# Altium project EGB220 V2.PrjPcb
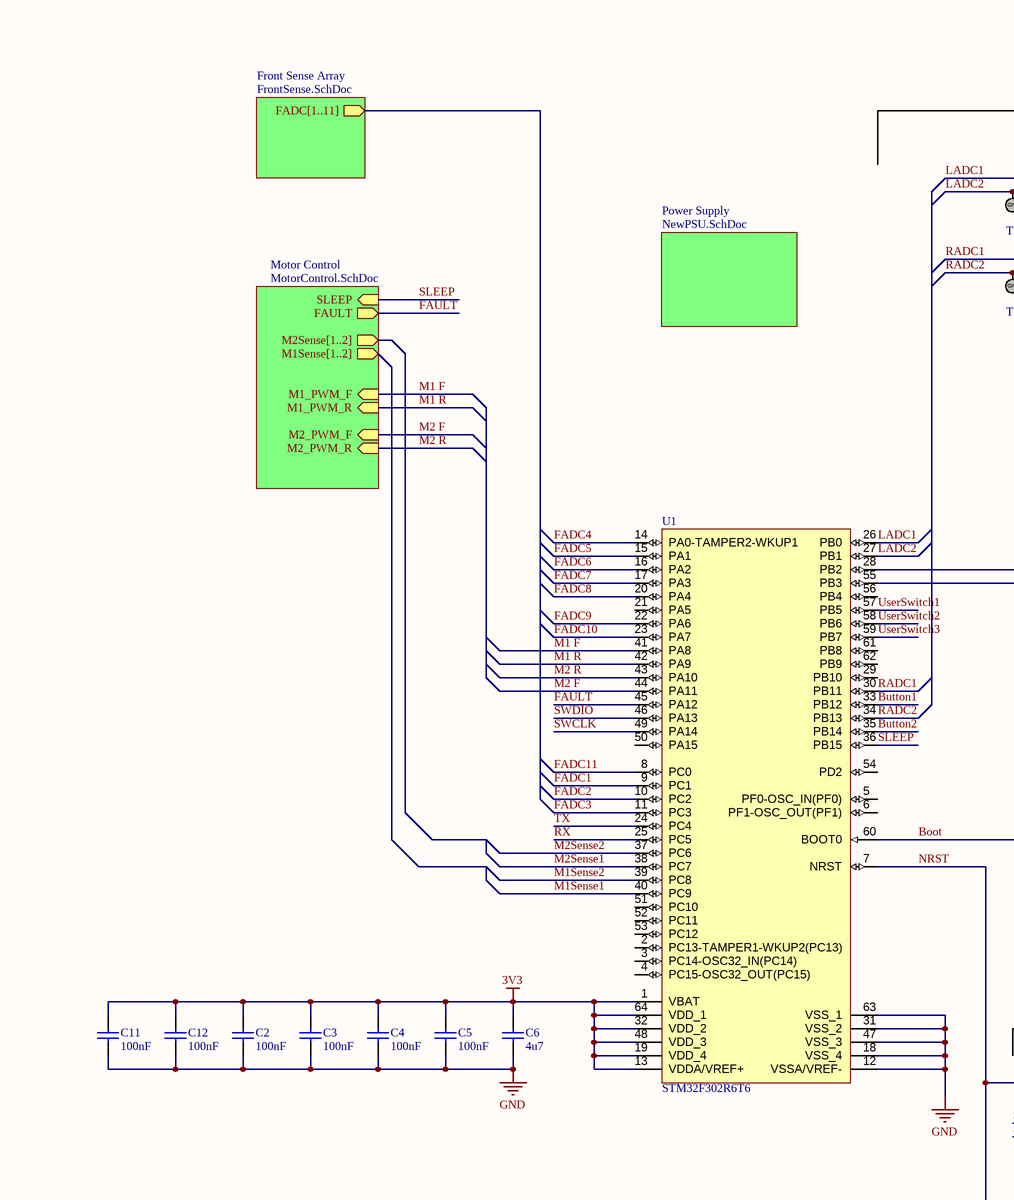
[diagram p0: EGB220.SchDoc, centre column 2 of 4]
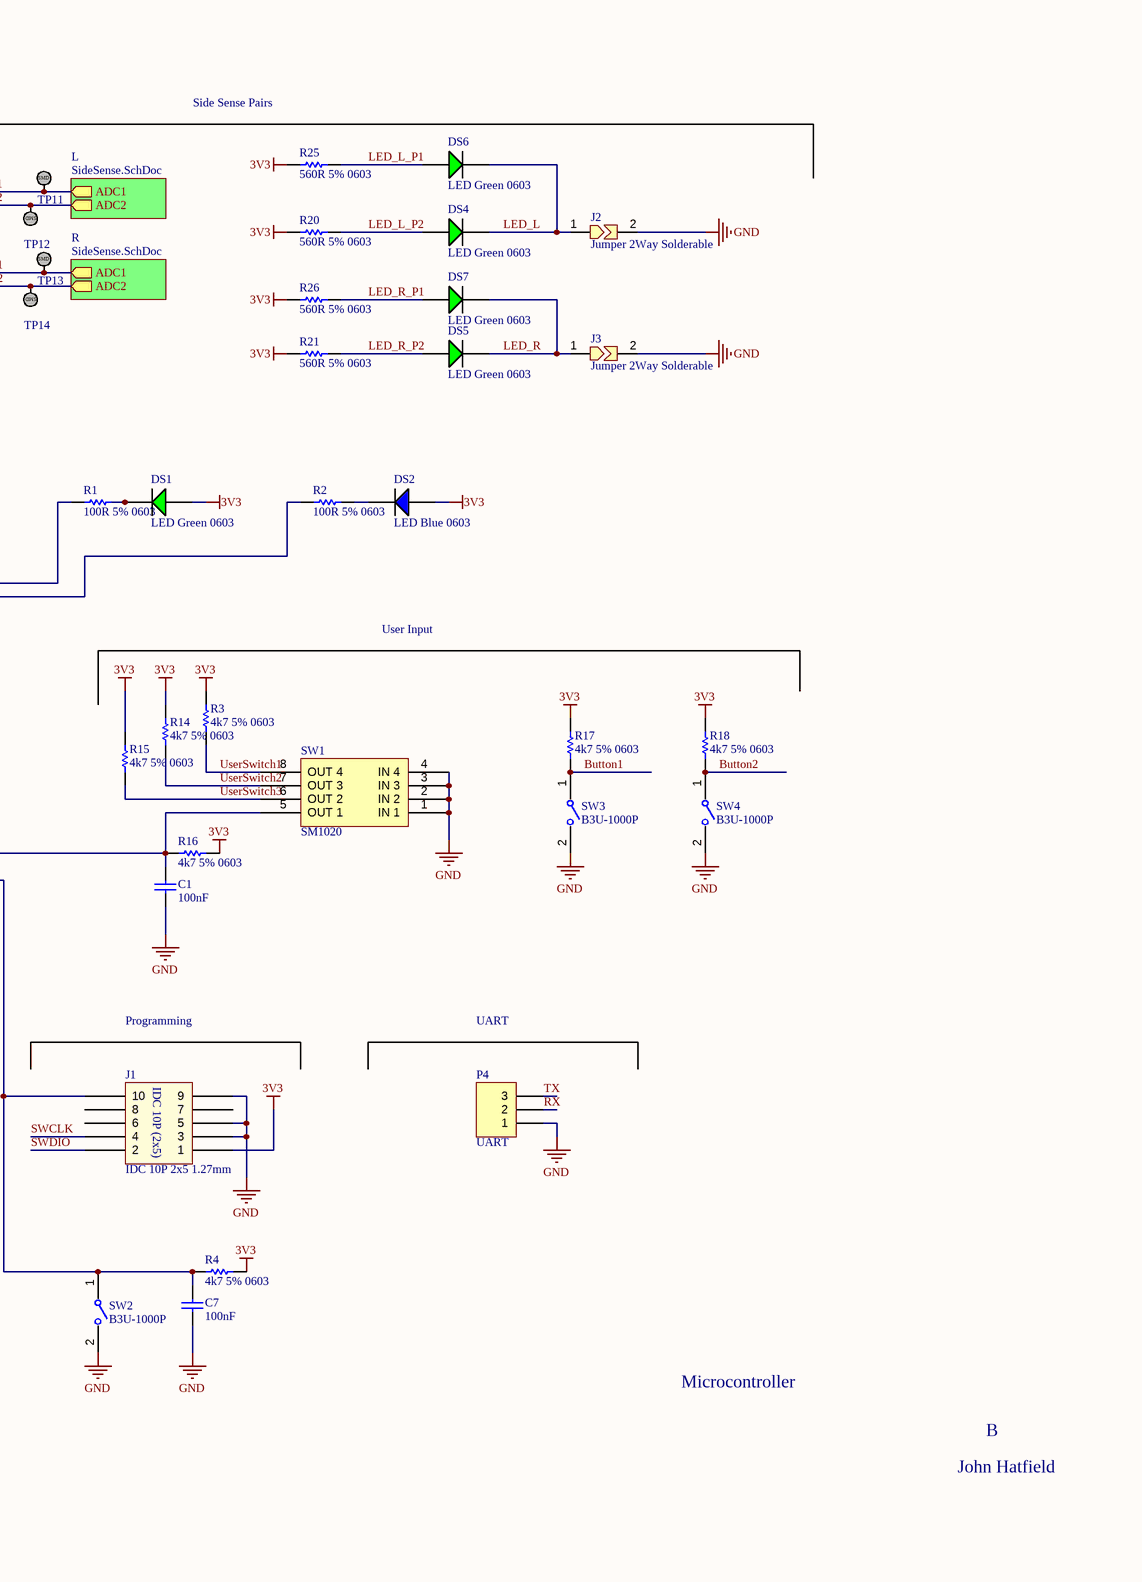
[diagram p1: EGB220.SchDoc, centre column 3 of 4]
6 sheets, 117 parts. Net scope: hierarchical (ports join the sheet entries above them; power ports are global).
Board files: v4.PcbDoc, v3.PcbDoc
Sheets:
  EGB220.SchDoc
    Front Sense Array = FrontSense.SchDoc
      P1 = SensePair.SchDoc
      P2 = SensePair.SchDoc
      P3 = SensePair.SchDoc
      P4 = SensePair.SchDoc
      P5 = SensePair.SchDoc
    Motor Control = MotorControl.SchDoc
    Power Supply = NewPSU.SchDoc
    L = SideSense.SchDoc
    R = SideSense.SchDoc

## Sheet EGB220.SchDoc: Test
size A3; Author: John Hatfield; DrawnBy: John Hatfield; SheetNumber: 1; SheetTotal: 6

### Parts
C1  100nF  [Cap_Ceramic_0603]
C2  100nF  [Cap_Ceramic_0603]
C3  100nF  [Cap_Ceramic_0603]
C4  100nF  [Cap_Ceramic_0603]
C5  100nF  [Cap_Ceramic_0603]
C6  4u7  [Cap_Ceramic_0603]
C7  100nF  [Cap_Ceramic_0603]
C11  100nF  [Cap_Ceramic_0603]
C12  100nF  [Cap_Ceramic_0603]
DS1  LED Green 0603  [LED GREEN 0603]
DS2  LED Blue 0603  [LED BLUE 0603]
DS4  LED Green 0603  [LED GREEN 0603]
DS5  LED Green 0603  [LED GREEN 0603]
DS6  LED Green 0603  [LED GREEN 0603]
DS7  LED Green 0603  [LED GREEN 0603]
J1  IDC 10P 2x5 1.27mm  [IDC 1.27MM 10P]
J2  Jumper 2Way Solderable  [Jumper_2Way_Solderable]
J3  Jumper 2Way Solderable  [Jumper_2Way_Solderable]
P4  UART  [HDR1X3]
R1  100R 5% 0603  [Res_ThinFilm_0603]
R2  100R 5% 0603  [Res_ThinFilm_0603]
R3  4k7 5% 0603  [Res_ThinFilm_0603]
R4  4k7 5% 0603  [Res_ThinFilm_0603]
R14  4k7 5% 0603  [Res_ThinFilm_0603]
R15  4k7 5% 0603  [Res_ThinFilm_0603]
R16  4k7 5% 0603  [Res_ThinFilm_0603]
R17  4k7 5% 0603  [Res_ThinFilm_0603]
R18  4k7 5% 0603  [Res_ThinFilm_0603]
R20  560R 5% 0603  [Res_ThinFilm_0603]
R21  560R 5% 0603  [Res_ThinFilm_0603]
R25  560R 5% 0603  [Res_ThinFilm_0603]
R26  560R 5% 0603  [Res_ThinFilm_0603]
SW1  SM1020  [SM1020]
SW2  B3U-1000P  [FP-B3U-1000P-MFG]
SW3  B3U-1000P  [FP-B3U-1000P-MFG]
SW4  B3U-1000P  [FP-B3U-1000P-MFG]
TP11  TestPoint_SMD  [TestPointSMD]  (value not drawn)
TP12  TestPoint_SMD  [TestPointSMD]  (value not drawn)
TP13  TestPoint_SMD  [TestPointSMD]  (value not drawn)
TP14  TestPoint_SMD  [TestPointSMD]  (value not drawn)
U1  STM32F302R6T6  [STM-LQFP64_L]

### Sub-sheets
Front Sense Array = FrontSense.SchDoc: FADC[1..11] (out)
L = SideSense.SchDoc: ADC1 (out), ADC2 (out)
Motor Control = MotorControl.SchDoc: M2Sense[1..2] (out), M1Sense[1..2] (out), M1_PWM_F (in), M1_PWM_R (in), M2_PWM_F (in), M2_PWM_R (in), FAULT (out), SLEEP (in)
Power Supply = NewPSU.SchDoc: no entries
R = SideSense.SchDoc: ADC1 (out), ADC2 (out)

### Nets
3V3: C2.2 C3.2 C4.2 C5.2 C6.2 C11.2 C12.2 DS1.1(A) DS2.1(A) J1.1 R3.2 R4.1 R14.2 R15.2 R16.1 R17.2 R18.2 R20.2 R21.2 R25.2 R26.2 U1.1(VBAT) U1.13(VDDA/VREF+) U1.19(VDD_4) U1.32(VDD_2) U1.48(VDD_3) U1.64(VDD_1)
GND: C1.1 C2.1 C3.1 C4.1 C5.1 C6.1 C7.1 C11.1 C12.1 J1.3 J1.5 J1.9 J2.2 J3.2 P4.1 SW1.1(IN_1) SW1.2(IN_2) SW1.3(IN_3) SW1.4(IN_4) SW2.2 SW3.2 SW4.2 U1.12(VSSA/VREF-) U1.18(VSS_4) U1.31(VSS_2) U1.47(VSS_3) U1.63(VSS_1)
Boot: C1.2 R16.2 SW1.5(OUT_1) U1.60(BOOT0)
Button1: R17.1 SW3.1 U1.33(PB12)
Button2: R18.1 SW4.1 U1.35(PB14)
FADC1: U1.9(PC1)
FADC2: U1.10(PC2)
FADC3: U1.11(PC3)
FADC4: U1.14(PA0-TAMPER2-WKUP1)
FADC5: U1.15(PA1)
FADC6: U1.16(PA2)
FADC7: U1.17(PA3)
FADC8: U1.20(PA4)
FADC9: U1.22(PA6)
FADC10: U1.23(PA7)
FADC11: U1.8(PC0)
FAULT: U1.45(PA12) ; sheet Motor Control/FAULT
LADC1: TP11.1 U1.26(PB0) ; sheet L/ADC1
LADC2: TP12.1 U1.27(PB1) ; sheet L/ADC2
LED_L: DS4.2(C) DS6.2(C) J2.1
LED_L_P1: DS6.1(A) R25.1
LED_L_P2: DS4.1(A) R20.1
LED_R: DS5.2(C) DS7.2(C) J3.1
LED_R_P1: DS7.1(A) R26.1
LED_R_P2: DS5.1(A) R21.1
M1 F: U1.41(PA8) ; sheet Motor Control/M1_PWM_F
M1 R: U1.42(PA9) ; sheet Motor Control/M1_PWM_R
M1Sense1: U1.40(PC9)
M1Sense2: U1.39(PC8)
M2 F: U1.44(PA11) ; sheet Motor Control/M2_PWM_F
M2 R: U1.43(PA10) ; sheet Motor Control/M2_PWM_R
M2Sense1: U1.38(PC7)
M2Sense2: U1.37(PC6)
NRST: C7.2 J1.10 R4.2 SW2.1 U1.7(NRST)
RADC1: TP13.1 U1.30(PB11) ; sheet R/ADC1
RADC2: TP14.1 U1.34(PB13) ; sheet R/ADC2
RX: P4.2 U1.25(PC5)
SLEEP: U1.36(PB15) ; sheet Motor Control/SLEEP
SWCLK: J1.4 U1.49(PA14)
SWDIO: J1.2 U1.46(PA13)
TX: P4.3 U1.24(PC4)
UserSwitch1: R3.1 SW1.8(OUT_4) U1.57(PB5)
UserSwitch2: R14.1 SW1.7(OUT_3) U1.58(PB6)
UserSwitch3: R15.1 SW1.6(OUT_2) U1.59(PB7)
NetDS1_2: DS1.2(C) R1.2
NetDS2_2: DS2.2(C) R2.2
NetR1_1: R1.1 U1.28(PB2)
NetR2_1: R2.1 U1.55(PB3)

Not connected (* = marked no-connect by the designer): J1 6 7 8; U1 2(PC13-TAMPER1-WKUP2(PC13)) 3(PC14-OSC32_IN(PC14)) 4(PC15-OSC32_OUT(PC15)) 5(PF0-OSC_IN(PF0)) 6(PF1-OSC_OUT(PF1)) 21(PA5) 29(PB10) 50(PA15) 51(PC10) 52(PC11) 53(PC12) 54(PD2) 56(PB4) 61(PB8) 62(PB9)

### Notes on the sheet
- Side Sense Pairs
- User Input
- Programming
- UART
- Microcontroller
- B
- John Hatfield
- (in symbol IDC 10P 2x5 1.27mm) IDC 10P (2x5)
- (in symbol TestPoint_SMD) SMD

### Library data of the parts
C1-C5 C7 C11 C12 = 100nF 50V 5% X7R 0603: Capacitor, Ceramic, SMD, 100nF, 50V, 5%, X7R, 0603
C6 = 4u7 50V 5% X7R 0603: Capacitor, Ceramic, SMD, 4u7, 50V, 5%, X7R, 0603
J2 J3 = Jumper 2Way Vert Solderable
P4 = Header 3: Header, 3-Pin; LatestRevisionDate: 17-Jul-2002; LatestRevisionNote: Re-released for DXP Platform.; Publisher: Altium Limited
R1 R2 = 100R 5%, 0603: Resistor, SMD, 100R, 0.1W, 5%, 0603
R3 R4 R14-R18 = 4k7 5% 0603: Resistor, SMD, 4k7, 0.1W, 5%, 0603
R20 R21 R25 R26 = 560R 5% 0603: Resistor, SMD, 560R, 0.1W, 5%, 0603
SW1 = SM1020: 4 Pin DIL Switch
SW2-SW4 = CMP-2100-03586-2: SWITCH TACTILE SPST-NO 0.05A 12V; Contact Resistance: 100mR; Operating Force: 1.5N; Max Current Rating: 50mA; Switch Travel: 0.15mm; Actuator Type: Standard; Mechanical Life: 200000Cycles; Ratings: Dust Proof; Illumination Type: Non-Illuminated; Throw Configuration: SPST; Actuator Length: 0.4mm; Switch Function: Off-Mom; Height: 1.2mm; Width: 3mm; Weight: 0.000776oz; Contact Material: Silver; Max Voltage Rating (DC): 12V; Insulation Resistance: 100MR; Lead Free: Lead Free; Current Rating: 50mA; Termination: SMD/SMT; Length: 4mm; Voltage Rating (DC): 12V; Contact Current Rating: 50mA; Orientation: Straight; Depth: 2.5mm; Max Operating Temperature: 70°C; Packaging: Tape and Reel; Min Operating Temperature: -25°C; Package Quantity: 1; Mount: Surface Mount; Electrical Life: 200000Cycles
U1 = CMP-0537-00017-1: ARM Cortex-M4 32-bit MCU, 32 KB Flash, 16 KB Internal RAM, 51 I/Os, 64-Pin LQFP, -40 to 85 degC, Tray; Operating Frequency(F) (Processor speed) (MHz): 72; Internal RAM Size (kB): 16; I/Os (High Current): 51; Supply Voltage(Vcc) min (V): 2; FLASH Size (Prog) (kB): 32; D/A Converter: 1; ComponentLink1Description: Manufacturer URL; Core: ARM Cortex-M4; Mounting Technology: Surface Mount; Packing: Tray; Package Description: 64-Pin Low-profile Quad Flat Package, Body 10 x 10 mm, Pitch 0.5 mm; ComponentLink2URL: http://www.st.com/st-web-ui/static/active/en/resource/technical/document/datasheet/DM00093333.pdf; Package Reference: LQFP64; ComponentLink1URL: http://www.st.com/; ComponentLink2Description: Datasheet; DatasheetVersion: Rev. 5

## Sheet FrontSense.SchDoc
size A4; SheetNumber: 2; SheetTotal: 6
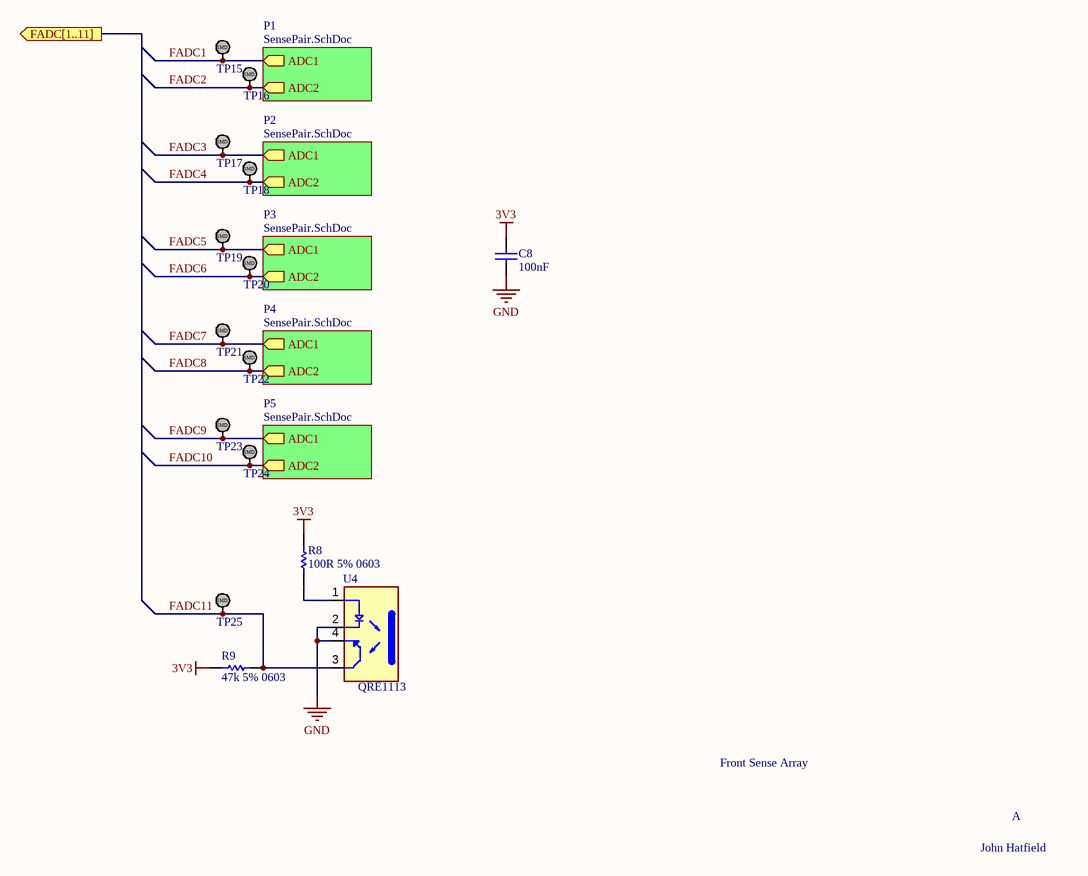
[diagram p2: FrontSense.SchDoc]

### Parts
C8  100nF  [Cap_Ceramic_0603]
R8  100R 5% 0603  [Res_ThinFilm_0603]
R9  47k 5% 0603  [Res_ThinFilm_0603]
TP15  TestPoint_SMD  [TestPointSMD]  (value not drawn)
TP16  TestPoint_SMD  [TestPointSMD]  (value not drawn)
TP17  TestPoint_SMD  [TestPointSMD]  (value not drawn)
TP18  TestPoint_SMD  [TestPointSMD]  (value not drawn)
TP19  TestPoint_SMD  [TestPointSMD]  (value not drawn)
TP20  TestPoint_SMD  [TestPointSMD]  (value not drawn)
TP21  TestPoint_SMD  [TestPointSMD]  (value not drawn)
TP22  TestPoint_SMD  [TestPointSMD]  (value not drawn)
TP23  TestPoint_SMD  [TestPointSMD]  (value not drawn)
TP24  TestPoint_SMD  [TestPointSMD]  (value not drawn)
TP25  TestPoint_SMD  [TestPointSMD]  (value not drawn)
U4  QRE1113  [DIP400W50P180L360H200Q4]

### Sub-sheets
P1 = SensePair.SchDoc: ADC1 (out), ADC2 (out)
P2 = SensePair.SchDoc: ADC1 (out), ADC2 (out)
P3 = SensePair.SchDoc: ADC1 (out), ADC2 (out)
P4 = SensePair.SchDoc: ADC1 (out), ADC2 (out)
P5 = SensePair.SchDoc: ADC1 (out), ADC2 (out)

### Ports
FADC[1..11] (out)

### Nets
3V3: C8.2 R8.2 R9.1
GND: C8.1 U4.2(C) U4.4(ET)
FADC1: TP15.1 ; sheet P1/ADC1
FADC2: TP16.1 ; sheet P1/ADC2
FADC3: TP17.1 ; sheet P2/ADC1
FADC4: TP18.1 ; sheet P2/ADC2
FADC5: TP19.1 ; sheet P3/ADC1
FADC6: TP20.1 ; sheet P3/ADC2
FADC7: TP21.1 ; sheet P4/ADC1
FADC8: TP22.1 ; sheet P4/ADC2
FADC9: TP23.1 ; sheet P5/ADC1
FADC10: TP24.1 ; sheet P5/ADC2
FADC11: R9.2 TP25.1 U4.3(CT)
NetR8_1: R8.1 U4.1(A)

### Notes on the sheet
- Front Sense Array
- A
- John Hatfield
- THIS DOCUMENT AND THE DATA DISCLOSED HEREIN OR
- HEREWITH IS THE PROPERTY OF ALTIUM LIMITED AND MAY
- DWG NO:
- REVISION
- REV:
- DESCRIPTION
- DATE
- APPROVED
- BE FREELY DISTRIBUTED IN WHOLE. NO RIGHTS ARE
- RESERVED OR EXPRESS OR IMPLIED WARANTEE GIVEN.
- ENG:
- APPROVALS
- PROJECT
- DSN:
- CHK:
- REFERENCE DOCUMENTS
- PROJECT REVISION:
- TITLE
- DOCUMENT REVISION:
- DESIGN ITEM:
- BOM:
- FAB DWG:
- PCB DWG:
- ASSY DWG:
- SCALE:
- A3
- SIZE
- CAGE CODE
- FILE NAME
- DWG NO.
- SHEET
- OF
- REV
- (in symbol TestPoint_SMD) SMD

### Library data of the parts
C8 = 100nF 50V 5% X7R 0603: as C1 on sheet EGB220
R8 = 100R 5%, 0603: Resistor, SMD, 100R, 0.1W, 5%, 0603
R9 = 47k 5% 0603: Resistor, SMD, 47k, 0.1W, 5%, 0603
U4 = QRE1113: Reflective Optical Sensor 0.197 _5mm_ 4-DIP _0.157, 4.00mm_; MF: ON Semiconductor; Availability: Unavailable; Package: DIP-4 ON Semiconductor; MP: QRE1113; Value: *; SnapEDA_Link: https://www.snapeda.com/parts/QRE1113/ON%20Semiconductor/view-part/2391104/?ref=snap; Price: None

## Sheet SensePair.SchDoc
size A4; SheetNumber: 3; SheetTotal: 6
Used 5 times, as channels Front Sense Array/P1, Front Sense Array/P2, Front Sense Array/P3, Front Sense Array/P4, Front Sense Array/P5. Parts and nets are listed once, with the designators drawn on the sheet.
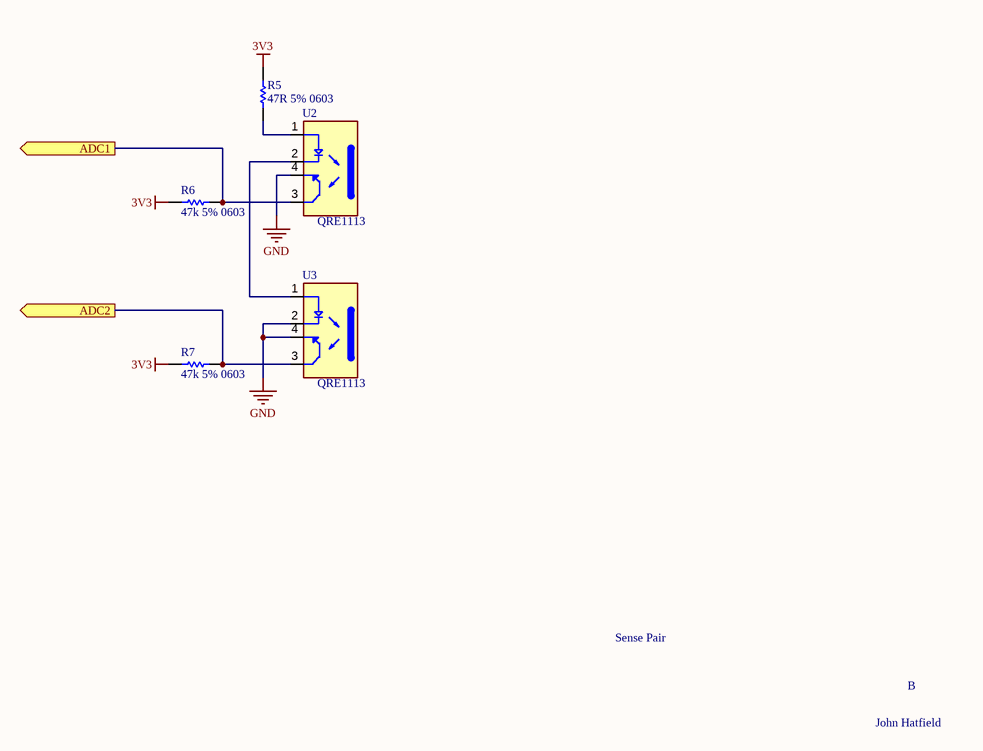
[diagram p3: SensePair.SchDoc]

### Parts
R5  47R 5% 0603  [Res_ThinFilm_0603]
R6  47k 5% 0603  [Res_ThinFilm_0603]
R7  47k 5% 0603  [Res_ThinFilm_0603]
U2  QRE1113  [DIP400W50P180L360H200Q4]
U3  QRE1113  [DIP400W50P180L360H200Q4]

### Ports
ADC1 (out), ADC2 (out)

### Nets
3V3: R5.2 R6.1 R7.1
GND: U2.4(ET) U3.2(C) U3.4(ET)
ADC1: R6.2 U2.3(CT) ; port ADC1
ADC2: R7.2 U3.3(CT) ; port ADC2
NetR5_1: R5.1 U2.1(A)
NetU2_2: U2.2(C) U3.1(A)

### Channels
Front Sense Array/P1: designators R5=P1_R5 R6=P1_R6 R7=P1_R7 U2=P1_U2 U3=P1_U3; ports ADC1=FADC1 ADC2=FADC2
Front Sense Array/P2: designators R5=P2_R5 R6=P2_R6 R7=P2_R7 U2=P2_U2 U3=P2_U3; ports ADC1=FADC3 ADC2=FADC4
Front Sense Array/P3: designators R5=P3_R5 R6=P3_R6 R7=P3_R7 U2=P3_U2 U3=P3_U3; ports ADC1=FADC5 ADC2=FADC6
Front Sense Array/P4: designators R5=P4_R5 R6=P4_R6 R7=P4_R7 U2=P4_U2 U3=P4_U3; ports ADC1=FADC7 ADC2=FADC8
Front Sense Array/P5: designators R5=P5_R5 R6=P5_R6 R7=P5_R7 U2=P5_U2 U3=P5_U3; ports ADC1=FADC9 ADC2=FADC10

### Notes on the sheet
- Sense Pair
- B
- John Hatfield
- THIS DOCUMENT AND THE DATA DISCLOSED HEREIN OR
- HEREWITH IS THE PROPERTY OF ALTIUM LIMITED AND MAY
- DWG NO:
- REVISION
- REV:
- DESCRIPTION
- DATE
- APPROVED
- BE FREELY DISTRIBUTED IN WHOLE. NO RIGHTS ARE
- RESERVED OR EXPRESS OR IMPLIED WARANTEE GIVEN.
- ENG:
- APPROVALS
- PROJECT
- DSN:
- CHK:
- REFERENCE DOCUMENTS
- PROJECT REVISION:
- TITLE
- DOCUMENT REVISION:
- DESIGN ITEM:
- BOM:
- FAB DWG:
- PCB DWG:
- ASSY DWG:
- SCALE:
- A3
- SIZE
- CAGE CODE
- FILE NAME
- DWG NO.
- SHEET
- OF
- REV

### Library data of the parts
R5 = 47R 5% 0603: Resistor, SMD, 47R, 0.1W, 5%, 0603
R6 R7 = 47k 5% 0603: Resistor, SMD, 47k, 0.1W, 5%, 0603
U2 U3 = QRE1113: as U4 on sheet FrontSense; Availability: Unavailable; Package: DIP-4 ON Semiconductor; MP: QRE1113; Value: *; SnapEDA_Link: https://www.snapeda.com/parts/QRE1113/ON%20Semiconductor/view-part/2391104/?ref=snap; Price: None

## Sheet MotorControl.SchDoc
size A3; SheetNumber: 4; SheetTotal: 6
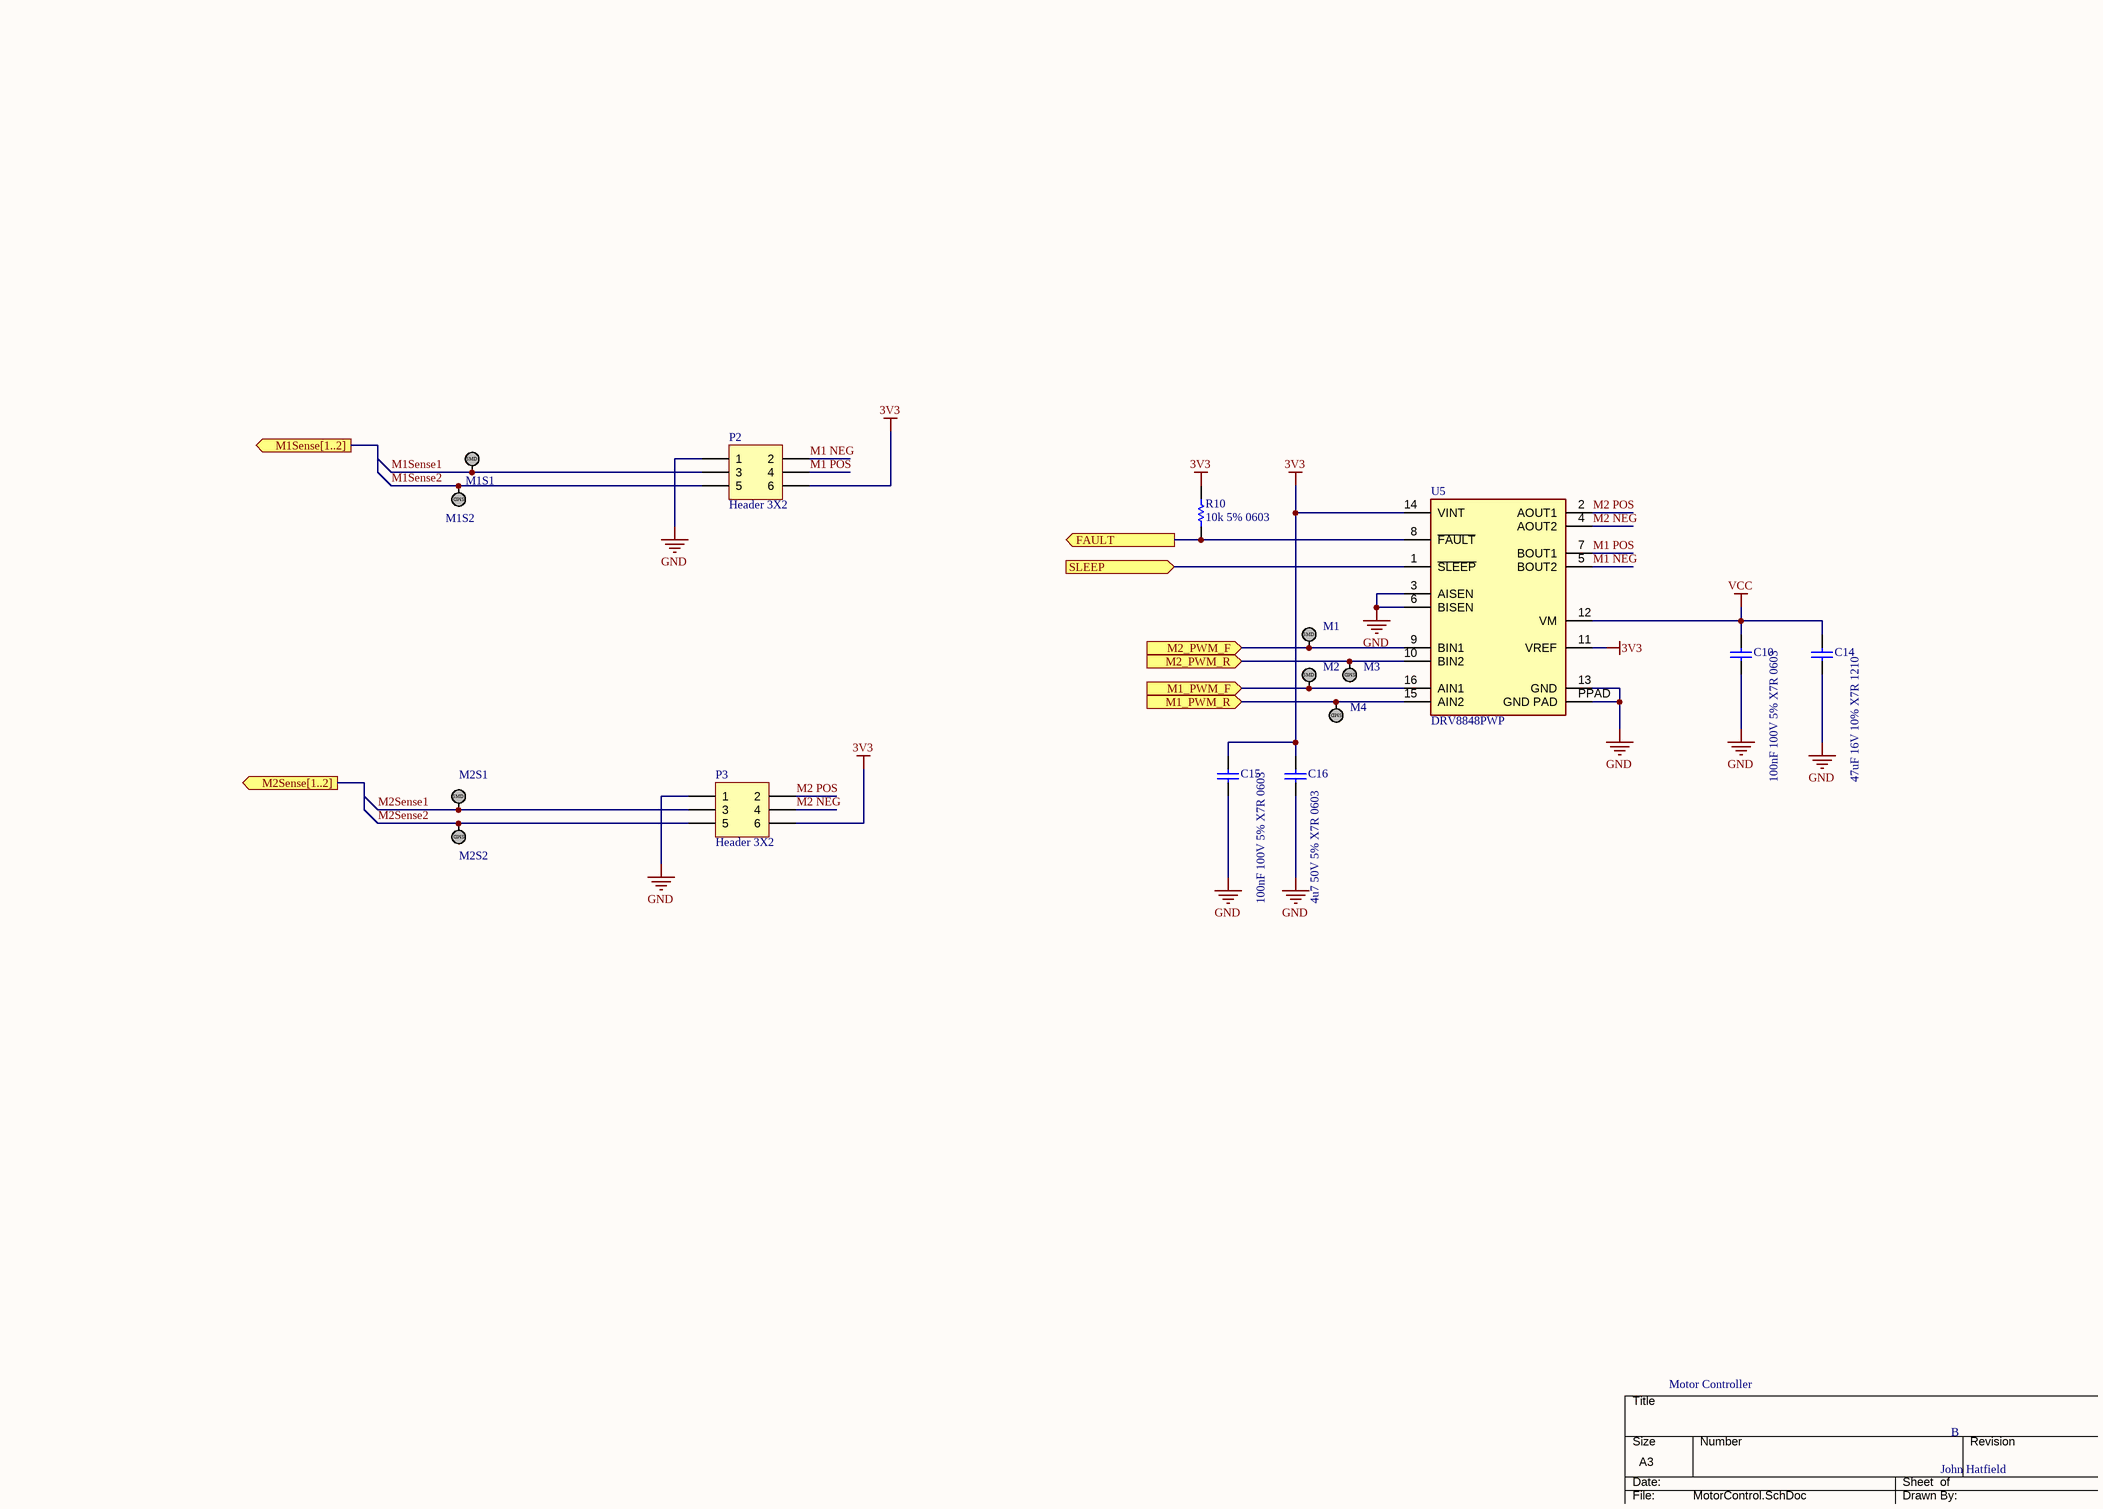
[diagram p4: MotorControl.SchDoc]

### Parts
C10  100nF 100V 5% X7R 0603  [Cap_Ceramic_0603]
C14  47uF 16V 10% X7R 1210  [Cap_Ceramic_1210]
C15  100nF 100V 5% X7R 0603  [Cap_Ceramic_0603]
C16  4u7 50V 5% X7R 0603  [Cap_Ceramic_0603]
M1  TestPoint_SMD  [TestPointSMD]  (value not drawn)
M1S1  TestPoint_SMD  [TestPointSMD]  (value not drawn)
M1S2  TestPoint_SMD  [TestPointSMD]  (value not drawn)
M2  TestPoint_SMD  [TestPointSMD]  (value not drawn)
M2S1  TestPoint_SMD  [TestPointSMD]  (value not drawn)
M2S2  TestPoint_SMD  [TestPointSMD]  (value not drawn)
M3  TestPoint_SMD  [TestPointSMD]  (value not drawn)
M4  TestPoint_SMD  [TestPointSMD]  (value not drawn)
P2  Header 3X2  [HDR2X3]
P3  Header 3X2  [HDR2X3]
R10  10k 5% 0603  [Res_ThinFilm_0603]
U5  Part Number: DRV8848PWP  [Texas_Instruments_PWP_R-PDSO-G16_0]  (hidden comment: IC_Texas_Instruments_DRV8848PWP_eec)

### Ports
FAULT (out), M1_PWM_F (in), M1_PWM_R (in), M1Sense[1..2] (out), M2_PWM_F (in), M2_PWM_R (in), M2Sense[1..2] (out), SLEEP (in)

### Nets
3V3: C15.2 C16.2 P2.6 P3.6 R10.2 U5.11(VREF) U5.14(VINT)
GND: C10.1 C14.1 C15.1 C16.1 P2.1 P3.1 U5.3(AISEN) U5.6(BISEN) U5.13(GND) U5.PPAD(GND_PAD)
VCC: C10.2 C14.2 U5.12(VM)
FAULT: R10.1 U5.8(~{FAULT}) ; port FAULT
M1 F: M2.1 U5.16(AIN1) ; port M1_PWM_F
M1 NEG: P2.2 U5.5(BOUT2)
M1 POS: P2.4 U5.7(BOUT1)
M1 R: M4.1 U5.15(AIN2) ; port M1_PWM_R
M1Sense1: M1S1.1 P2.3
M1Sense2: M1S2.1 P2.5
M2 F: M1.1 U5.9(BIN1) ; port M2_PWM_F
M2 NEG: P3.4 U5.4(AOUT2)
M2 POS: P3.2 U5.2(AOUT1)
M2 R: M3.1 U5.10(BIN2) ; port M2_PWM_R
M2Sense1: M2S1.1 P3.3
M2Sense2: M2S2.1 P3.5
SLEEP: U5.1(~{SLEEP}) ; port SLEEP

### Notes on the sheet
- Motor Controller
- B
- John Hatfield
- THIS DOCUMENT AND THE DATA DISCLOSED HEREIN OR
- HEREWITH IS THE PROPERTY OF ALTIUM LIMITED AND MAY
- DWG NO:
- REVISION
- REV:
- DESCRIPTION
- DATE
- APPROVED
- BE FREELY DISTRIBUTED IN WHOLE. NO RIGHTS ARE
- RESERVED OR EXPRESS OR IMPLIED WARANTEE GIVEN.
- ENG:
- APPROVALS
- PROJECT
- DSN:
- CHK:
- REFERENCE DOCUMENTS
- PROJECT REVISION:
- TITLE
- DOCUMENT REVISION:
- DESIGN ITEM:
- BOM:
- FAB DWG:
- PCB DWG:
- ASSY DWG:
- SCALE:
- A3
- SIZE
- CAGE CODE
- FILE NAME
- DWG NO.
- SHEET
- OF
- REV
- (in symbol TestPoint_SMD) SMD

### Library data of the parts
C10 C15 = 100nF 100V 5% X7R 0603: Capacitor, Ceramic, SMD, 100nF, 100V, 5%, X7R, 0603
C14 = 47uF 16V 10% X7R 1210: Capacitor, Ceramic, SMD, 47uF, 16V, 5%, X7R, 1210
C16 = 4u7 50V 5% X7R 0603: as C6 on sheet EGB220
P2 P3 = Header 3X2: Header, 3-Pin, Dual row; LatestRevisionDate: 17-Jul-2002; LatestRevisionNote: Re-released for DXP Platform.; Publisher: Altium Limited
R10 = 10k 5% 0603: Resistor, SMD, 10k, 0.1W, 5%, 0603
U5 = IC_Texas_Instruments_DRV8848PWP_eec: IC MOTOR DRIVER PAR 16HTSSOP; Manufacturer: Texas Instruments; Voltage: 18V; Mfg Package Ident: PWP (R-PDSO-G16); helpURL: https://upverter.com/upn/revision/bddc272fce7c23e8/; ComponentLink2Description: Datasheet; Temperature: -40°C to +85°C; Package: PWP (R-PDSO-G16); Supplier 2: Mouser; Price: 1.93395746176; Supplier 1: Digi-Key; ComponentLink1URL: https://upverter.com/upn/revision/bddc272fce7c23e8/; Supplier Part Number 2: 595-DRV8848PWP; Supplier Part Number 1: 296-38514-5-ND; ComponentLink1Description: Upverter; ComponentLink2URL: http://www.ti.com/lit/ds/symlink/drv8848.pdf; RoHS: TRUE; Mouser Part Number: 595-DRV8848PWP; Temperature Range High: +85°C; Digikey Description: IC MOTOR DRIVER PAR 16HTSSOP; Digikey Part Number: 296-38514-5-ND; Lead Free: yes; Temperature Range Low: -40°C

## Sheet NewPSU.SchDoc
size A4; SheetNumber: 6; SheetTotal: 6
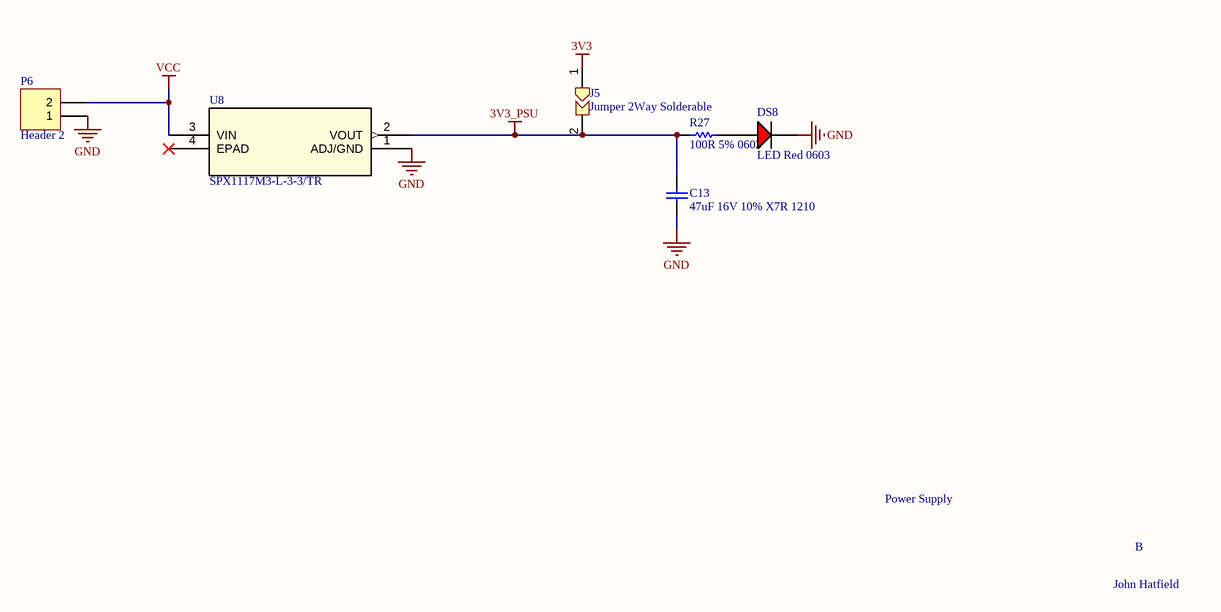
[diagram p5: NewPSU.SchDoc]

### Parts
C13  47uF 16V 10% X7R 1210  [Cap_Ceramic_1210]
DS8  LED Red 0603  [LED RED 0603]
J5  Jumper 2Way Solderable  [Jumper_2Way_Solderable]
P6  Header 2  [HDR1X2]
R27  100R 5% 0603  [Res_ThinFilm_0603]
U8  SPX1117M3-L-3-3/TR  [SOT223-3_MXL]

### Nets
3V3: J5.1
3V3_PSU: C13.2 J5.2 R27.1 U8.2(VOUT)
GND: C13.1 DS8.2(C) P6.1 U8.1(ADJ/GND)
VCC: P6.2 U8.3(VIN)
NetDS8_1: DS8.1(A) R27.2

Not connected (* = marked no-connect by the designer): U8 4(EPAD)*

### Notes on the sheet
- Power Supply
- B
- John Hatfield
- THIS DOCUMENT AND THE DATA DISCLOSED HEREIN OR
- HEREWITH IS THE PROPERTY OF ALTIUM LIMITED AND MAY
- DWG NO:
- REVISION
- REV:
- DESCRIPTION
- DATE
- APPROVED
- BE FREELY DISTRIBUTED IN WHOLE. NO RIGHTS ARE
- RESERVED OR EXPRESS OR IMPLIED WARANTEE GIVEN.
- ENG:
- APPROVALS
- PROJECT
- DSN:
- CHK:
- REFERENCE DOCUMENTS
- PROJECT REVISION:
- TITLE
- DOCUMENT REVISION:
- DESIGN ITEM:
- BOM:
- FAB DWG:
- PCB DWG:
- ASSY DWG:
- SCALE:
- A3
- SIZE
- CAGE CODE
- FILE NAME
- DWG NO.
- SHEET
- OF
- REV

### Library data of the parts
C13 = 47uF 16V 10% X7R 1210: as C14 on sheet MotorControl
J5 = Jumper 2Way Vert Solderable
P6 = Header 2: Header, 2-Pin; LatestRevisionDate: 17-Jul-2002; LatestRevisionNote: Re-released for DXP Platform.; Publisher: Altium Limited
R27 = 100R 5%, 0603: Resistor, SMD, 100R, 0.1W, 5%, 0603
U8 = SPX1117M3-L-3-3/TR: No Description Available; Vendor: Max Linear; Built_By: EMA_Molly; SourceLibrary: Max_Linear_2019-12-20; Manufacturer_Part_Number: SPX1117M3-L-3-3/TR; Copyright: Copyright (C) 2018 Accelerated Designs. All rights reserved; RefDes: RefDes; Type: DEV

## Sheet SideSense.SchDoc
size A4; SheetNumber: 5; SheetTotal: 6
Used 2 times, as channels L, R. Parts and nets are listed once, with the designators drawn on the sheet.
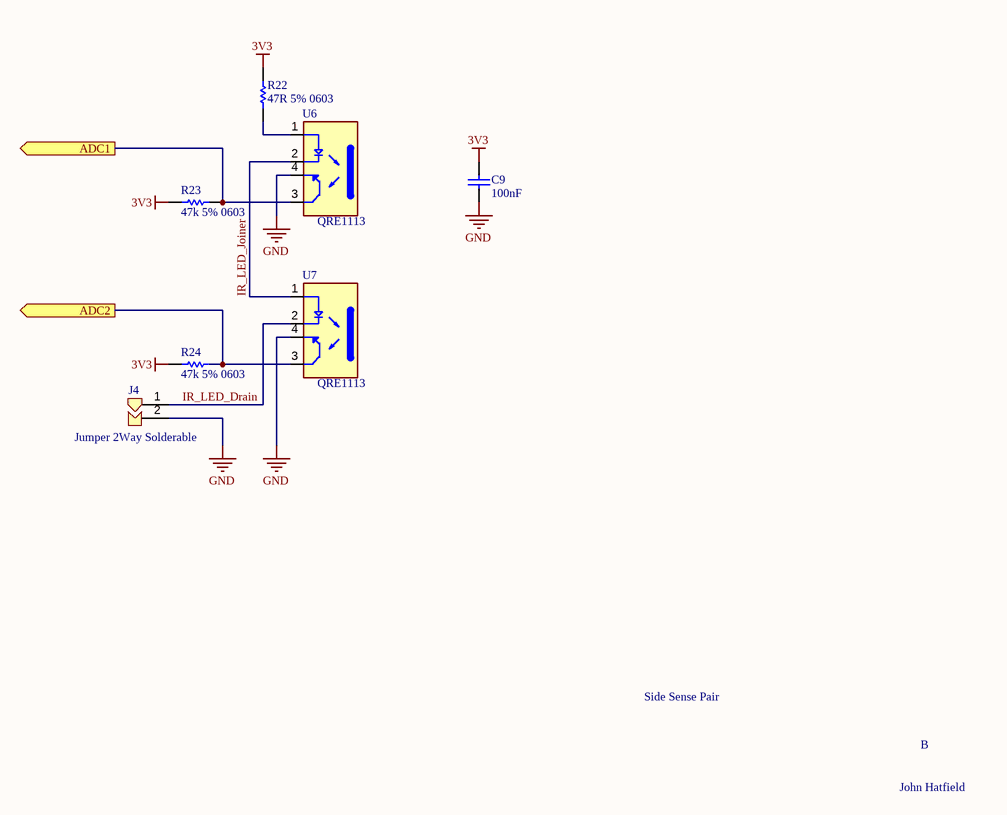
[diagram p6: SideSense.SchDoc]

### Parts
C9  100nF  [Cap_Ceramic_0603]
J4  Jumper 2Way Solderable  [Jumper_2Way_Solderable]
R22  47R 5% 0603  [Res_ThinFilm_0603]
R23  47k 5% 0603  [Res_ThinFilm_0603]
R24  47k 5% 0603  [Res_ThinFilm_0603]
U6  QRE1113  [DIP400W50P180L360H200Q4]
U7  QRE1113  [DIP400W50P180L360H200Q4]

### Ports
ADC1 (out), ADC2 (out)

### Nets
3V3: C9.2 R22.2 R23.1 R24.1
GND: C9.1 J4.2 U6.4(ET) U7.4(ET)
ADC1: R23.2 U6.3(CT) ; port ADC1
ADC2: R24.2 U7.3(CT) ; port ADC2
IR_LED_Drain: J4.1 U7.2(C)
IR_LED_Joiner: U6.2(C) U7.1(A)
NetR22_1: R22.1 U6.1(A)

### Channels
L: designators C9=L_C9 J4=L_J4 R22=L_R22 R23=L_R23 R24=L_R24 U6=L_U6 U7=L_U7; ports ADC1=LADC1 ADC2=LADC2
R: designators C9=R_C9 J4=R_J4 R22=R_R22 R23=R_R23 R24=R_R24 U6=R_U6 U7=R_U7; ports ADC1=RADC1 ADC2=RADC2

### Notes on the sheet
- Side Sense Pair
- B
- John Hatfield

### Library data of the parts
C9 = 100nF 50V 5% X7R 0603: as C1 on sheet EGB220
J4 = Jumper 2Way Side Solderable
R22 = 47R 5% 0603: Resistor, SMD, 47R, 0.1W, 5%, 0603
R23 R24 = 47k 5% 0603: Resistor, SMD, 47k, 0.1W, 5%, 0603
U6 U7 = QRE1113: as U4 on sheet FrontSense; Availability: Unavailable; Package: DIP-4 ON Semiconductor; MP: QRE1113; Value: *; SnapEDA_Link: https://www.snapeda.com/parts/QRE1113/ON%20Semiconductor/view-part/2391104/?ref=snap; Price: None

## Nets that join several sheets
3V3: EGB220 (27 pins), FrontSense (C8.2 R8.2 R9.1), Front Sense Array/P1 (P1_R5.2 P1_R6.1 P1_R7.1), Front Sense Array/P2 (P2_R5.2 P2_R6.1 P2_R7.1), Front Sense Array/P3 (P3_R5.2 P3_R6.1 P3_R7.1), Front Sense Array/P4 (P4_R5.2 P4_R6.1 P4_R7.1), Front Sense Array/P5 (P5_R5.2 P5_R6.1 P5_R7.1), MotorControl (7 pins), NewPSU (J5.1), L (L_C9.2 L_R22.2 L_R23.1 L_R24.1), R (R_C9.2 R_R22.2 R_R23.1 R_R24.1)
GND: EGB220 (27 pins), FrontSense (C8.1 U4.2 U4.4), Front Sense Array/P1 (P1_U2.4 P1_U3.2 P1_U3.4), Front Sense Array/P2 (P2_U2.4 P2_U3.2 P2_U3.4), Front Sense Array/P3 (P3_U2.4 P3_U3.2 P3_U3.4), Front Sense Array/P4 (P4_U2.4 P4_U3.2 P4_U3.4), Front Sense Array/P5 (P5_U2.4 P5_U3.2 P5_U3.4), MotorControl (10 pins), NewPSU (C13.1 DS8.2 P6.1 U8.1), L (L_C9.1 L_J4.2 L_U6.4 L_U7.4), R (R_C9.1 R_J4.2 R_U6.4 R_U7.4)
VCC: MotorControl (C10.2 C14.2 U5.12), NewPSU (P6.2 U8.3)
FADC1: FrontSense (TP15.1), Front Sense Array/P1 (P1_R6.2 P1_U2.3)
FADC2: FrontSense (TP16.1), Front Sense Array/P1 (P1_R7.2 P1_U3.3)
FADC3: FrontSense (TP17.1), Front Sense Array/P2 (P2_R6.2 P2_U2.3)
FADC4: FrontSense (TP18.1), Front Sense Array/P2 (P2_R7.2 P2_U3.3)
FADC5: FrontSense (TP19.1), Front Sense Array/P3 (P3_R6.2 P3_U2.3)
FADC6: FrontSense (TP20.1), Front Sense Array/P3 (P3_R7.2 P3_U3.3)
FADC7: FrontSense (TP21.1), Front Sense Array/P4 (P4_R6.2 P4_U2.3)
FADC8: FrontSense (TP22.1), Front Sense Array/P4 (P4_R7.2 P4_U3.3)
FADC9: FrontSense (TP23.1), Front Sense Array/P5 (P5_R6.2 P5_U2.3)
FADC10: FrontSense (TP24.1), Front Sense Array/P5 (P5_R7.2 P5_U3.3)
FAULT: EGB220 (U1.45), MotorControl (R10.1 U5.8)
LADC1: EGB220 (TP11.1 U1.26), L (L_R23.2 L_U6.3)
LADC2: EGB220 (TP12.1 U1.27), L (L_R24.2 L_U7.3)
M1 F: EGB220 (U1.41), MotorControl (M2.1 U5.16)
M1 R: EGB220 (U1.42), MotorControl (M4.1 U5.15)
M2 F: EGB220 (U1.44), MotorControl (M1.1 U5.9)
M2 R: EGB220 (U1.43), MotorControl (M3.1 U5.10)
RADC1: EGB220 (TP13.1 U1.30), R (R_R23.2 R_U6.3)
RADC2: EGB220 (TP14.1 U1.34), R (R_R24.2 R_U7.3)
SLEEP: EGB220 (U1.36), MotorControl (U5.1)